# EAGLE schematic esp12StackFTDI (EAGLE 7.7.0)
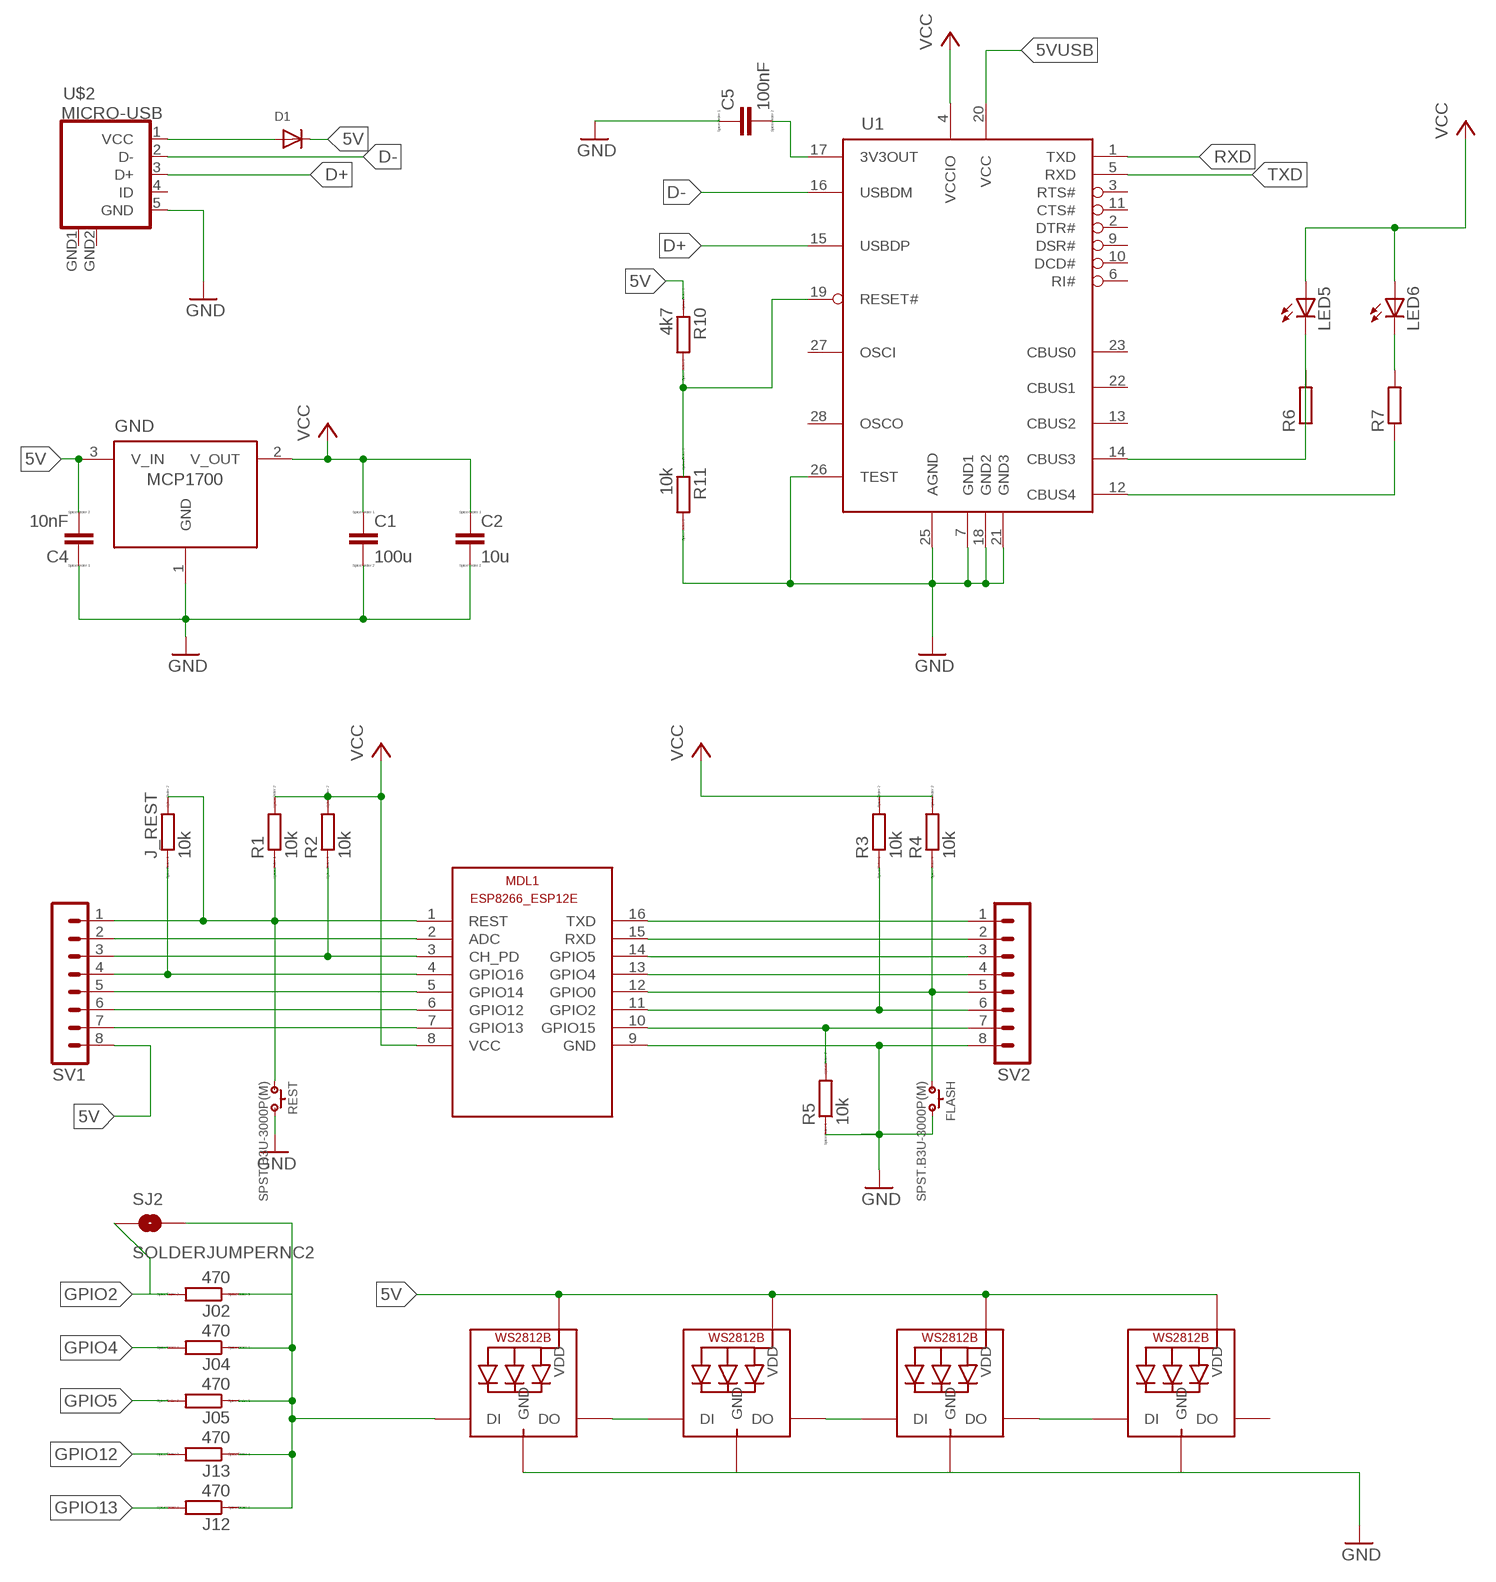
[diagram p0: schematic, sheet 1]

## Parts
C1  100u  C  [C0805]
C2  10u  C  [C0805]
C4  10nF  C  [C0805]
C5  100nF  C  [C0805]
D1  DIODESOD-323F  [SOD-323F]
FLASH  SPST.B3U-3000P(M)  [B3U-3000P(M)]
GND  MCP1700SOT23  [SOT-23]
J02  470  RR0603  [R0603]
J04  470  RR0603  [R0603]
J05  470  RR0603  [R0603]
J12  470  RR0603  [R0603]
J13  470  RR0603  [R0603]
J_REST  10k  RR0603  [R0603]
LED1  WS2812B5050  [WS2812B]
LED2  WS2812B5050  [WS2812B]
LED3  WS2812B5050  [WS2812B]
LED4  WS2812B5050  [WS2812B]
LED5  LEDCHIPLED_0603  [CHIPLED_0603]
LED6  LEDCHIPLED_0603  [CHIPLED_0603]
MDL1  ESP8266-12EESP8266-ESP12E  [ESP8266-ESP12E]
R1  10k  RR0603  [R0603]
R2  10k  RR0603  [R0603]
R3  10k  RR0603  [R0603]
R4  10k  RR0603  [R0603]
R5  10k  RR0603  [R0603]
R6  R-EU_R0603  [R0603]
R7  R-EU_R0603  [R0603]
R10  4k7  RR0603  [R0603]
R11  10k  RR0603  [R0603]
REST  SPST.B3U-3000P(M)  [B3U-3000P(M)]
SJ2  SOLDERJUMPERNC2  [SJ_2S-NOTRACE]
SV1  MA08-1  [MA08-1]
SV2  MA08-1  [MA08-1]
U1  FT232RL  [SSOP28DB]
U$2  MICRO-USB  [MICRO-USB]

## Nets
3V3: C1.1 C2.1 GND.2(V_OUT) LED5.A LED6.A MDL1.8(VCC) R1.2 R2.2 R3.2 R4.2 U1.4(VCCIO) ; supply symbol labelled VCC
3V3OUT: C5.2 U1.17(3V3OUT)
5V: C4.2 D1.C GND.3(V_IN) LED1.1-VDD(VDD) LED2.1-VDD(VDD) LED3.1-VDD(VDD) LED4.1-VDD(VDD) R10.1 SV1.8 U1.20(VCC)
5VUSB: D1.A U$2.1(VCC)
ADC: MDL1.2(ADC) SV1.2
CBUS3: R6.2 U1.14(CBUS3)
CBUS4: R7.1 U1.12(CBUS4)
CH_PD: MDL1.3(CH_PD) R2.1 SV1.3
D+: U1.15(USBDP) U$2.3(D+)
D-: U1.16(USBDM) U$2.2(D-)
DIN1: J02.1 J04.1 J05.1 J12.1 J13.1 LED1.4-DIN(DI) SJ2.2
DOUT1DIN2: LED1.2-DOUT(DO) LED2.4-DIN(DI)
DOUT2DIN3: LED2.2-DOUT(DO) LED3.4-DIN(DI)
DOUT3DIN4: LED3.2-DOUT(DO) LED4.4-DIN(DI)
GND: C1.2 C2.2 C4.1 C5.1 FLASH.2 GND.1(GND) LED1.3-GND(GND) LED2.3-GND(GND) LED3.3-GND(GND) LED4.3-GND(GND) MDL1.9(GND) R5.1 R11.2 REST.2 SV2.8 U1.7(GND1) U1.18(GND2) U1.21(GND3) U1.25(AGND) U1.26(TEST) U$2.5(GND)
GPIO0: FLASH.1 MDL1.12(GPIO0) R4.1 SV2.5
GPIO2: J02.2 MDL1.11(GPIO2) R3.1 SJ2.1 SV2.6
GPIO4: J04.2 MDL1.13(GPIO4) SV2.4
GPIO5: J05.2 MDL1.14(GPIO5) SV2.3
GPIO12: J13.2 MDL1.6(GPIO12) SV1.6
GPIO13: J12.2 MDL1.7(GPIO13) SV1.7
GPIO14: MDL1.5(GPIO14) SV1.5
GPIO15: MDL1.10(GPIO15) R5.2 SV2.7
GPIO16: J_REST.1 MDL1.4(GPIO16) SV1.4
LED_RX: LED6.C R7.2
LED_TX: LED5.C R6.1
RESET: R10.2 R11.1 U1.19(RESET#)
REST: J_REST.2 MDL1.1(REST) R1.1 REST.1 SV1.1
RXD: MDL1.15(RXD) SV2.2 U1.1(TXD)
TXD: MDL1.16(TXD) SV2.1 U1.5(RXD)
Unconnected: LED4.2-DOUT(DO) U1.2(DTR#) U1.3(RTS#) U1.6(RI#) U1.9(DSR#) U1.10(DCD#) U1.11(CTS#) U1.13(CBUS2) U1.22(CBUS1) U1.23(CBUS0) U1.27(OSCI) U1.28(OSCO) U$2.4(ID)

## Power pins joined to a net without a drawn wire
GND: U$2.GND1(GND) U$2.GND2(GND)

## Library data of the parts
C1 C2 C4 C5 = eagle-ltspice:C: CAPACITOR, European symbol; SPICEMODEL: NONE; SPICEPREFIX: C
D1 = adafruit:DIODE: Diode SMADIODE - SMA Surface Mount Package 20V 1A Schottky Diode Digikey: 641-1014-6-ND DO-1N4148 - Through Hole Small Current Diode SOD-123 20V 1 A (.5mV Vf) Schottky Diode - Digikey: MBRX120TPMSCT-ND SOD-323 10V 570mA (.38mV Vf, 3ns) Schottky Diode - Digikey: ZLLS410CT-ND SOD-523 30V 30mA Schottky Diode (RB751S-40TE61) - Digikey: RB751S-40TE61CT-ND SOT23-R/W - SOT23 Package (R = Solder Paste/Reflow Ovens, W = Hand-Soldering) BAT54Film 40V 300mA - Digikey: 497-7162-1-ND
FLASH REST = omron:SPST
GND = MCP1700:MCP1700SOT23
J02 J04 J05 J12 J13 J_REST R1-R5 R10 R11 = eagle-ltspice:R: RESISTOR, European symbol; SPICEMODEL: NONE; SPICEPREFIX: R
LED1-LED4 = adafruit:WS2812B
LED5 LED6 = adafruit:LED: LED OSRAM: - CHIPLED LG R971, LG N971, LY N971, LG Q971, LY Q971, LO R971, LY R971 LH N974, LH R974 LS Q976, LO Q976, LY Q976 LO Q996 - Hyper CHIPLED LW Q18S LB Q993, LB Q99A, LB R99A - SideLED LS A670, LO A670, LY A670, LG A670, LP A670 LB A673, LV A673, LT A673, LW A673 LH A674 LY A675 LS A676, LA A676, LO A676, LY A676, LW A676 LS A679, LY A679, LG A679 - Hyper Micro SIDELED® LS Y876, LA Y876, LO Y876, LY Y876 LT Y87S - SmartLED LW L88C, LW L88S LB L89C, LB L89S, LG L890 LS L89K, LO L89K, LY L89K LS L896, LA L896, LO L896, LY L896 - TOPLED LS T670, LO T670, LY T670, LG T670, LP T670 LSG T670, LSP T670, LSY T670, LOP T670, LYG T670 LG T671, LOG T671, LSG T671 LB T673, LV T673, LT T673, LW T673 LH T674 LS T676, LA T676, LO T676, LY T676, LB T676, LH T676, LSB T676, LW T676 LB T67C, LV T67C, LT T67C, LS T67K, LO T67K, LY T67K, LW E67C LS E67B, LA E67B, LO E67B, LY E67B, LB E67C, LV E67C, LT E67C LW T67C LS T679, LY T679, LG T679 LS T770, LO T770, LY T770, LG T770, LP T770 LB T773, LV T773, LT T773, LW T773 LH T774 LS E675, LA E675, LY E675, LS T675 LS T776, LA T776, LO T776, LY T776, LB T776 LHGB T686 LT T68C, LB T68C - Hyper Mini TOPLED® LB M676 - Mini TOPLED Santana® LG M470 LS M47K, LO M47K, LY M47K Source: http://www.osram.convergy.de/
MDL1 = ESP12E:ESP8266-12E: ESP8266-12E with additional I/O and GPIO04/05 corrected The author cannot warrant that this library is free from error or will meet your specific requirements. Created by PuceBaboon.com. Komagane, Nagano, JAPAN
R6 R7 = rcl:R-EU_: RESISTOR, European symbol
SJ2 = SparkFun:SOLDERJUMPER: Solder Jumper Standard SMD solder jumper. Used to automate production. Two varients : Normally Open and Normally Closed are the same, but have different paste layers. NC will have a large amount of paste and should jumper during reflow.
SV1 SV2 = con-lstb:MA08-1: PIN HEADER; OC_FARNELL: unknown; OC_NEWARK: unknown
U1 = ftdichip-4:FT232RL: USB UART 4th Generation USB UART (USB <-> Serial) Controller
U$2 = microusb (1):MICRO-USB: Micro USB B connector